# Altium schematic sheet PCB原理图.SchDoc
size A4
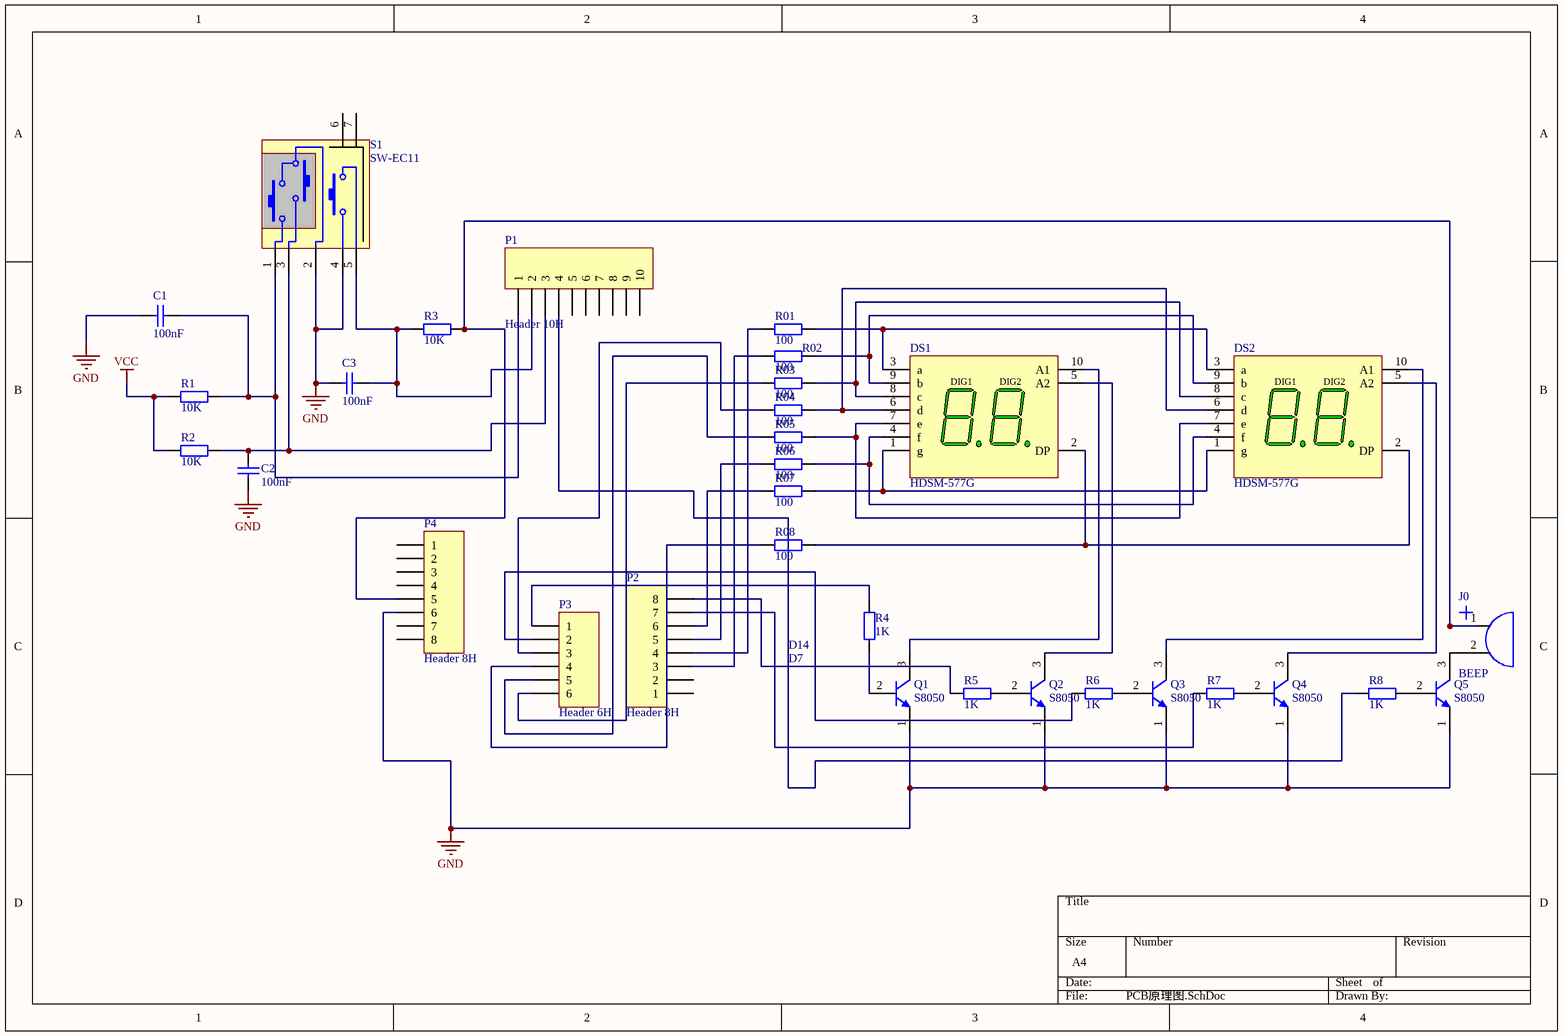
[diagram p0: PCB原理图.SchDoc]

## Parts
C1  value 100nF  [RAD0.2]  (hidden comment: Cap)
C2  value 100nF  [RAD0.2]  (hidden comment: Cap)
C3  value 100nF  [RAD0.2]  (hidden comment: Cap)
DS1  HDSM-577G  [HDSM-577]
DS2  HDSM-577G  [HDSM-577]
J0  BEEP  [Beep]
P1  Header 10H  [HDR1X10]
P2  Header 8H  [HDR1X8]
P3  Header 6H  [HDR1X6]
P4  Header 8H  [HDR1X8]
Q1  S8050  [TO-92A]
Q2  S8050  [TO-92A]
Q3  S8050  [TO-92A]
Q4  S8050  [TO-92A]
Q5  S8050  [TO-92A]
R1  value 10K  [AXIAL0.3]  (hidden comment: Res1)
R01  value 100  [AXIAL0.3]  (hidden comment: Res1)
R2  value 10K  [AXIAL0.3]  (hidden comment: Res1)
R02  value 100  [AXIAL0.3]  (hidden comment: Res1)
R3  value 10K  [AXIAL0.3]  (hidden comment: Res1)
R03  value 100  [AXIAL0.3]  (hidden comment: Res1)
R04  value 100  [AXIAL0.3]  (hidden comment: Res1)
R4  value 1K  [AXIAL0.3]  (hidden comment: Res1)
R05  value 100  [AXIAL0.3]  (hidden comment: Res1)
R5  value 1K  [AXIAL0.3]  (hidden comment: Res1)
R06  value 100  [AXIAL0.3]  (hidden comment: Res1)
R6  value 1K  [AXIAL0.3]  (hidden comment: Res1)
R07  value 100  [AXIAL0.3]  (hidden comment: Res1)
R7  value 1K  [AXIAL0.3]  (hidden comment: Res1)
R08  value 100  [AXIAL0.3]  (hidden comment: Res1)
R8  value 1K  [AXIAL0.3]  (hidden comment: Res1)
S1  SW-EC11  [EC11]

## Nets
GND: C1.2 C2.1 C3.2 P4.6 Q1.1(E) Q2.1(E) Q3.1(E) Q4.1(E) Q5.1(E) S1.2 S1.4
VCC: R1.1 R2.1
NetC1_1: C1.1 P1.1 R1.2 S1.1
NetC2_2: C2.2 P1.3 R2.2 S1.3
NetC3_1: C3.1 P1.2 R3.1 S1.5
NetDS1_1: DS1.1(g) DS2.1(g) R07.2
NetDS1_2: DS1.2(DP) DS2.2(DP) R08.2
NetDS1_3: DS1.3(a) DS2.3(a) R01.2
NetDS1_4: DS1.4(f) DS2.4(f) R06.2
NetDS1_5: DS1.5(A2) Q2.3(C)
NetDS1_6: DS1.6(d) DS2.6(d) R04.2
NetDS1_7: DS1.7(e) DS2.7(e) R05.2
NetDS1_8: DS1.8(c) DS2.8(c) R03.2
NetDS1_9: DS1.9(b) DS2.9(b) R02.2
NetDS1_10: DS1.10(A1) Q1.3(C)
NetDS2_5: DS2.5(A2) Q4.3(C)
NetDS2_10: DS2.10(A1) Q3.3(C)
NetJ0_1: J0.1 P4.5 R3.2
NetJ0_2: J0.2 Q5.3(C)
NetP1_4: P1.4 R8.1
NetP2_3: P2.3 R02.1
NetP2_4: P2.4 R01.1
NetP2_5: P2.5 R06.1
NetP2_6: P2.6 R07.1
NetP2_7: P2.7 R7.1
NetP2_8: P2.8 R5.1
NetP3_1: P3.1 R4.2
NetP3_2: P3.2 R6.1
NetP3_3: P3.3 R04.1
NetP3_4: P3.4 R08.1
NetP3_5: P3.5 R05.1
NetP3_6: P3.6 R03.1
NetQ1_2: Q1.2(B) R4.1
NetQ2_2: Q2.2(B) R5.2
NetQ3_2: Q3.2(B) R6.2
NetQ4_2: Q4.2(B) R7.2
NetQ5_2: Q5.2(B) R8.2

Not connected (* = marked no-connect by the designer): P1 5 6 7 8 9 10; P2 1 2; P4 1 2 3 4 7 8; S1 6 7

## Notes on the sheet
- D14
- D7
- (in symbol HDSM-577G) DIG1; DIG2

## Library data of the parts
C1-C3 = Cap: 无极性电容; Published: 8-Jun-2000; LatestRevisionDate: 17-Jul-2002; LatestRevisionNote: Re-released for DXP Platform.; PackageReference: RAD-0.3; Publisher: Altium Limited
DS1 DS2 = HDSM-577G: 9.2 mm Green 7-Segment Display: 2-Digit, RH DP; LuminousIntensity: 1100 ucd (Minimum).; Published: 26-May-2004; LatestRevisionDate: 11-Oct-2004; LatestRevisionNote: Display outline superimposed on PCB Footprint.; DatasheetDocument: 14-Mar-2003; PackageDocument: 14-Mar-2003; PackageReference: HDSM-577; Publisher: Altium Limited; LED_Colour: Green; ComponentLink1Description: Manufacturer Link; ComponentLink1URL: http://www.agilent.com/
J0 = BEEP: 蜂鸣器
P1 = Header 10H: Header, 10-Pin, Right Angle; LatestRevisionDate: 17-Jul-2002; LatestRevisionNote: Re-released for DXP Platform.; Publisher: Altium Limited
P2 P4 = Header 8H: Header, 8-Pin, Right Angle; LatestRevisionDate: 17-Jul-2002; LatestRevisionNote: Re-released for DXP Platform.; Publisher: Altium Limited
P3 = Header 6H: Header, 6-Pin, Right Angle; LatestRevisionDate: 17-Jul-2002; LatestRevisionNote: Re-released for DXP Platform.; Publisher: Altium Limited
Q1-Q5 = S8050: NPN三极管; Published: 8-Jun-2000; LatestRevisionDate: 15-Jan-2003; LatestRevisionNote: PCB Footprint 'BCY-W3/D4.7' replaced; DatasheetDocument: 1997; PackageDocument: Sep-1998; PackageReference: TO-92A; Publisher: Altium Limited; Code_JEDEC: TO-92A; ComponentLink1Description: Manufacturer Link; ComponentLink1URL: http://www.fairchildsemi.com/; ComponentLink2Description: Datasheet; ComponentLink2URL: http://www.fairchildsemi.com/ds/2N%2F2N3904.pdf
R1 R01 R2 R02 R3 R03 R04 R4 R05 R5 R06 R6 R07 R7 R08 R8 = Res1: 贴片电阻; Published: 8-Jun-2000; LatestRevisionDate: 17-Jul-2002; LatestRevisionNote: Re-released for DXP Platform.; PackageReference: AXIAL-0.4; Publisher: Altium Limited
S1 = SW-EC11: 旋转编码开关; Published: 24-Mar-1999; LatestRevisionDate: 17-Jul-2002; LatestRevisionNote: Re-released for DXP Platform.; PackageReference: SPST-2; Publisher: Altium Limited